# Altium schematic sheet [02]PowerProtections.SchDoc
size A4; SheetNumber: 2; SheetTotal: 5
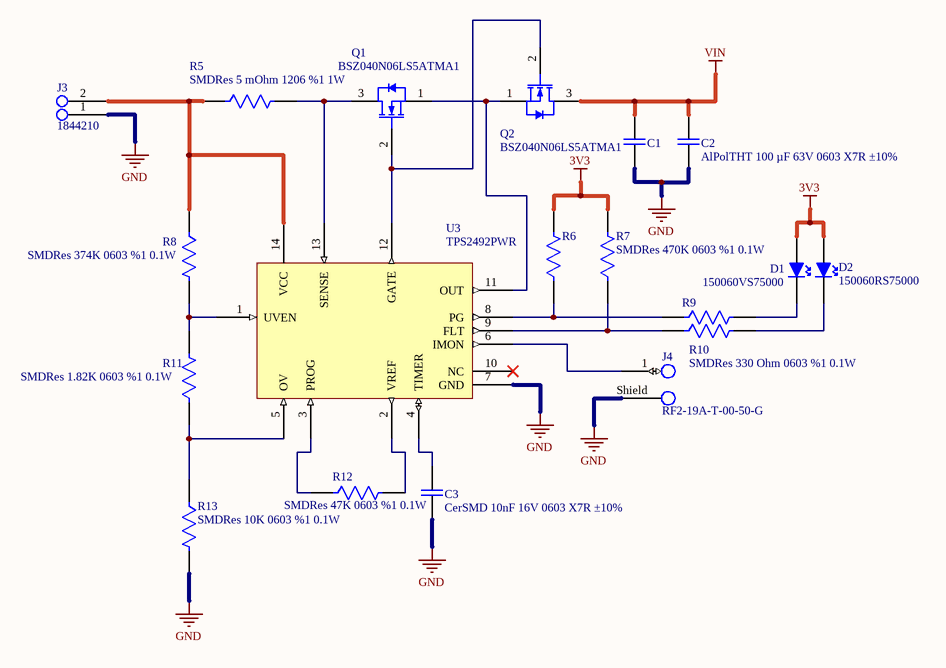
[diagram p0: [02]PowerProtections.SchDoc]

## Parts
C1  AlPolTHT 100 µF 63V 0603 X7R ±10%  [107AVG063MFBJ]  (value not drawn)
C2  AlPolTHT 100 µF 63V 0603 X7R ±10%  [107AVG063MFBJ]
C3  CerSMD 10nF 16V 0603 X7R ±10%  [CAPC1608X09N]
D1  150060VS75000  [LED1608X08N]
D2  150060RS75000  [LED1608X08N]
J3  1844210  [1844210]
J4  RF2-19A-T-00-50-G  [RF2-19A-T-00-50-G]
Q1  BSZ040N06LS5ATMA1  [PG-TSDSON-8-FL]
Q2  BSZ040N06LS5ATMA1  [PG-TSDSON-8-FL]
R5  SMDRes 5 mOhm 1206 %1 1W  [RESC3116X10N]
R6  SMDRes 470K 0603 %1 0.1W  [RESC1508X06N]  (value not drawn)
R7  SMDRes 470K 0603 %1 0.1W  [RESC1508X06N]
R8  SMDRes 374K 0603 %1 0.1W  [RESC1508X06N]
R9  MDRes 330 Ohm 0603 %1 0.1W  [RESC1508X06N]  (value not drawn)
R10  SMDRes 330 Ohm 0603 %1 0.1W  [RESC1508X06N]
R11  SMDRes 1.82K 0603 %1 0.1W  [RESC1508X06N]
R12  SMDRes 47K 0603 %1 0.1W  [RESC1508X06N]
R13  SMDRes 10K 0603 %1 0.1W  [RESC1508X06N]
U3  TPS2492PWR  [TSOP65P640X120-14L]

## Nets
3V3: D1.1(A) D2.1(A) R6.2 R7.2
GND: C1.2 C2.2 C3.2 J3.1 J4.Shield R13.2 U3.7(GND)
VIN: C1.1 C2.1 Q2.3(D)
NetC3_1: C3.1 U3.4(TIMER)
NetD1_2: D1.2(K) R9.2
NetD2_2: D2.2(K) R10.2
NetJ3_2: J3.2 R5.1 R8.1 U3.14(VCC)
NetJ4_1: J4.1 U3.6(IMON)
NetQ1_1: Q1.1(S) Q2.1(S) U3.11(OUT)
NetQ1_2: Q1.2(G) Q2.2(G) U3.12(GATE)
NetQ1_3: Q1.3(D) R5.2 U3.13(SENSE)
NetR6_1: R6.1 R9.1 U3.8(PG)
NetR7_1: R7.1 R10.1 U3.9(FLT)
NetR8_2: R8.2 R11.2 U3.1(UVEN)
NetR11_1: R11.1 R13.1 U3.5(OV)
NetR12_1: R12.1 U3.3(PROG)
NetR12_2: R12.2 U3.2(VREF)

Not connected (* = marked no-connect by the designer): U3 10(NC)*

## Notes on the sheet
- Title:
- Size:
- Date:
- A4
- Number:
- Time:
- Revision:
- Sheet
- of
- Project
- Drawn By :

## Library data of the parts
C1 C2 = CMP-00002-4: Ceramic Capacitor SMD 100 µF 63V 0603 X7R ±10%; Manufacturer: Cornell Dubilier Knowles; Digi-Key Part Number: 1572-1656-ND; Voltage: 63V; Mounting Type: Surface Mount; Tolerance: ±10%; Manufacturer Number: 107AVG063MFBJ; Package: 0603; Temperature Coefficient: X7R; Temperature: -55°C up to 125°C; Mouser Part Number: 598-107AVG063MFBJ
C3 = CMP-00001-3: Ceramic Capacitor SMD  10nF 16V 0603 X7R ±10%; Manufacturer Number: CL10B103KO8WPNC; Manufacturer: Samsung Electro-Mechanics; Digi-Key Part Number: 1276-CL10B103KO8WPNCCT-ND; Voltage: 16V; Mounting Type: Surface Mount; Temperature: -55°C up to 125°C; Tolerance: ±10%; Mouser Part Number: 187-CL10B103KO8WPNC; Package: 0603; Temperature Coefficient: X7R
D1 = CMP-00028-1: GREEN LED 0603
D2 = CMP-00024-1: RED LED 0603
J3 = CMP-00023-1: 12A 2-Pos, Right Angle
J4 = CMP-00025-2: Rf Sma Connector
Q1 Q2 = CMP-00004-1: N-MOS 60V 17A (Ta) 101A (Tc)
R5 = CMP-00007-2: 5 mOhms ±1% 1W Chip Resistor 1206 (3216 Metric) Automotive AEC-Q200, Current Sense, Moisture Resistant Metal Foil; Manufacturer Number: CSRF1206FT5L00; Manufacturer: Stackpole Electronics Inc; Temperature: -55°C up to 170°C; Digi-Key Part Number: CSRF1206FT5L00CT-ND; Tolerance: ±1%; Mouser Part Number: 708-CSRF1206FT5L00; Mounting Type: Surface Mount; Package: 1206; Power: 1W
R6 R7 = CMP-00006-1: Res Thick Film 0603 470K Ohm 1% 0.1W(1/10W) ±100ppm/C Pad SMD T/R Automotive AEC-Q200; Manufacturer: Stackpole Electronics Inc; Manufacturer Number: RMCF0603FT470K; Mouser Part Number: 708-RMCF0603FT470K; Power: 0.1W; Tolerance: ±1%; Digi-Key Part Number: RMCF0603FT470KCT-ND; Package: 0603; Mounting Type: Surface Mount; Temperature: -55°C up to 155°C
R8 = CMP-00005-2: Res Thick Film 0603 374K Ohm 1% 0.1W(1/10W) ±100ppm/C Pad SMD T/R Automotive AEC-Q200; Manufacturer: Stackpole Electronics Inc; Manufacturer Number: RMCF0603FT374K; Power: 0.1W; Temperature: -55°C up to 155°C; Mounting Type: Surface Mount; Package: 0603; Digi-Key Part Number: RMCF0603FT374KCT-ND; Mouser Part Number: 708-RMCF0603FT374K; Tolerance: ±1%
R9 R10 = CMP-00027-1: Res Thick Film 0603 33 kOhm Ohm 1% 0.1W(1/10W) ±100ppm/C Pad SMD T/R Automotive AEC-Q200; Manufacturer Number: RMCF0603FT330R; Manufacturer: Stackpole Electronics Inc; Mounting Type: Surface Mount; Mouser Part Number: 708-RMCF0603FT330R; Tolerance: ±1%; Digi-Key Part Number: RMCF0603FT330RCT-ND; Temperature: -55°C up to 155°C; Package: 0603; Power: 0.1W
R11 = CMP-00003-2: Res Thick Film 0603 1.82K Ohm 1% 0.1W(1/10W) ±100ppm/C Pad SMD T/R Automotive AEC-Q200; Manufacturer: Stackpole Electronics Inc; Manufacturer Number: RMCF0603FT1K82; Mouser Part Number: 708-RMCF0603FT1K82; Power: 0.1W; Package: 0603; Tolerance: ±1%; Mounting Type: Surface Mount; Digi-Key Part Number: RMCF0603FT1K82CT-ND; Temperature: -55°C up to 155°C
R12 = CMP-00008-1: Res Thick Film 0603 47K Ohm 1% 0.1W(1/10W) ±100ppm/C Pad SMD T/R Automotive AEC-Q200; Manufacturer Number: RMCF0603FT47K0; Manufacturer: Stackpole Electronics Inc; Power: 0.1W; Tolerance: ±1%; Mounting Type: Surface Mount; Temperature: -55°C up to 155°C; Digi-Key Part Number: RMCF0603FT47K0CT-ND; Mouser Part Number: 708-RMCF0603FT47K0; Package: 0603
R13 = CMP-00001-1-1: Res Thick Film 0603 10K Ohm 1% 0.1W(1/10W) ±100ppm/C Pad SMD T/R Automotive AEC-Q200; Manufacturer Number: RMCF0603FT10K0; Manufacturer: Stackpole Electronics Inc; Power: 0.1W; Mouser Part Number: 708-RMCF0603FT10K0; Tolerance: ±1%; Package: 0603; Mounting Type: Surface Mount; Digi-Key Part Number: RMCF0603FT10K0CT-ND; Temperature: -55°C up to 155°C
U3 = CMP-00000-2: eFuses - External MOSFETs - 9V-80V; Manufacturer: Texas Instruments; Temperature Rating: -40°C up to 125°C; Voltage Rating: 9V up to 80V; Internal Switch(s): No; Features: Adjustable Current Limit, Adjustable Soft Start, Current Monitoring, Fault Output, Overcurrent Protection, Overvoltage Protection, Power Good Signal, Short Circuit Protection, Adjustable UVLO; Package: 14-TSSOP; Manufacturer Number: TPS2492PWR; Mouser Part Number: 595-TPS2492PWR; Mount Type: Surface Mount; Digi-Key Part Number: 296-39373-1-ND